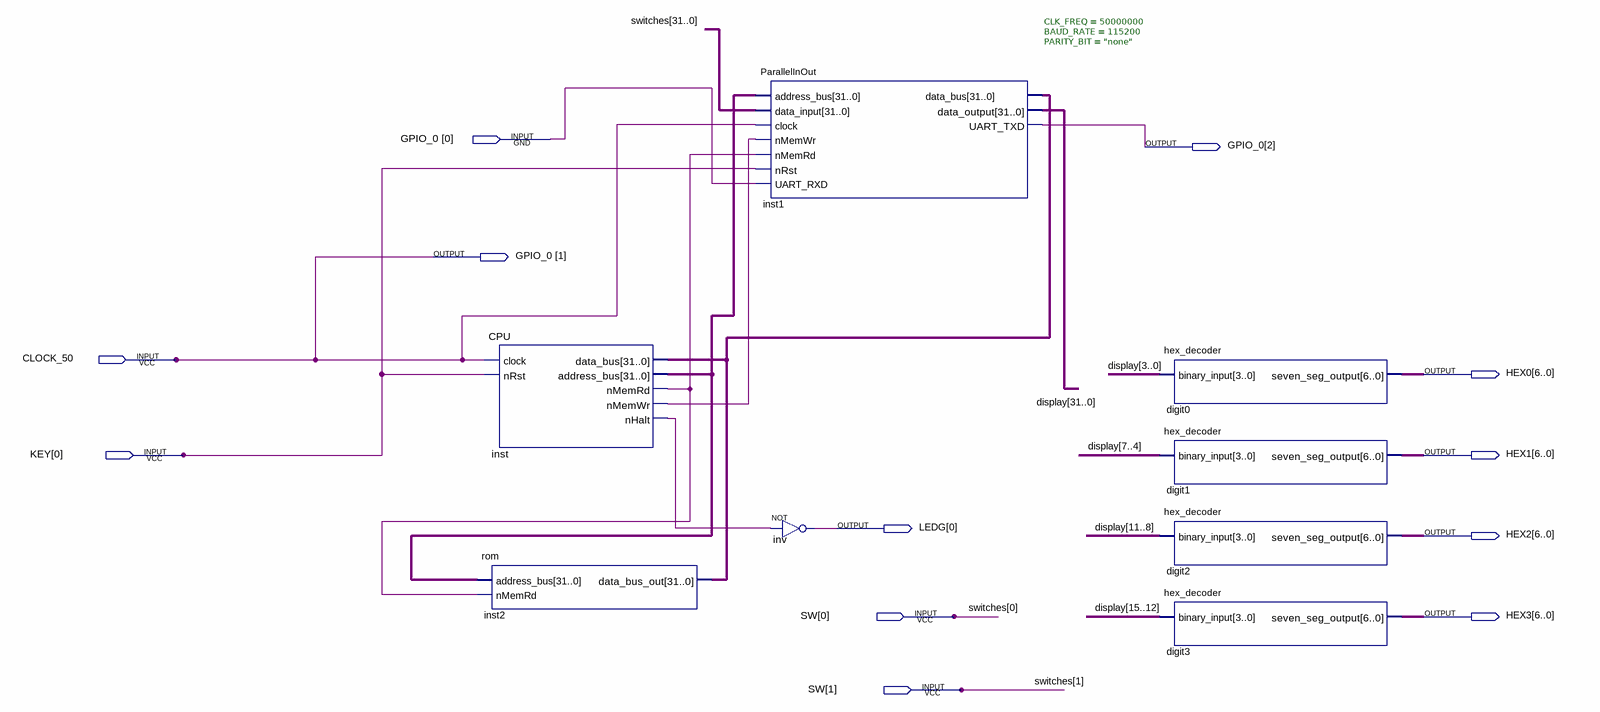
[diagram p0: schematic sheet]
// Quartus schematic SoC.bdf as structural Verilog: 8 symbols, 12 pins
module SoC (
  inout  [2:0] GPIO_0,
  input  CLOCK_50,
  input  [0:0] KEY,
  input  [1:0] SW,
  output [6:0] HEX0,
  output [6:0] HEX1,
  output [0:0] LEDG,
  output [6:0] HEX2,
  output [6:0] HEX3
);

  wire inst_nhalt, inst_nmemrd, inst_nmemwr;
  wire [31:0] display, inst_address_bus, inst_data_bus;
  wire [31:2] switches;

  CPU inst (
    .clock(CLOCK_50), .nRst(KEY[0]), .address_bus(inst_address_bus), .nMemRd(inst_nmemrd),
    .nMemWr(inst_nmemwr), .nHalt(inst_nhalt), .data_bus(inst_data_bus));
  rom inst2 (.address_bus(inst_address_bus), .nMemRd(inst_nmemrd), .data_bus_out(inst_data_bus));
  ParallelInOut #(.CLK_FREQ(50000000), .BAUD_RATE(115200), .PARITY_BIT("none")) inst1 (
    .address_bus(inst_address_bus), .data_input({switches, SW}), .clock(CLOCK_50), .nMemWr(inst_nmemwr),
    .nMemRd(inst_nmemrd), .nRst(KEY[0]), .UART_RXD(GPIO_0[0]), .data_output(display), .UART_TXD(GPIO_0[2]),
    .data_bus(inst_data_bus));
  not inv (LEDG[0], inst_nhalt);
  hex_decoder digit0 (.binary_input(display[3:0]), .seven_seg_output(HEX0));
  hex_decoder digit1 (.binary_input(display[7:4]), .seven_seg_output(HEX1));
  hex_decoder digit2 (.binary_input(display[11:8]), .seven_seg_output(HEX2));
  hex_decoder digit3 (.binary_input(display[15:12]), .seven_seg_output(HEX3));

  assign GPIO_0[1] = CLOCK_50;

  // Other names for the same wires on the sheet: switches[1:0] = SW
endmodule
